# EAGLE design SerialSignal (EAGLE 6.1)
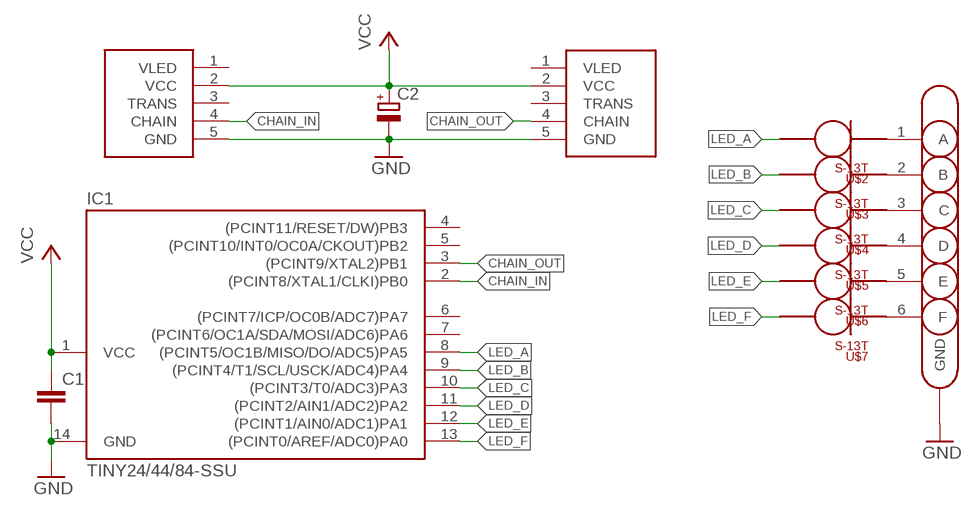
[diagram p0: schematic, sheet 1]

## Parts
C1  C-EUC0603  [C0603]
C2  CPOL-EUSMCC  [SMC_C]
IC1  TINY24/44/84-SSU  [SOIC14]
SMD1  SERIAL_SENSOR  [SERIAL_4]
SMD2  SERIAL_SENSOR  [SERIAL_4]
U$1  SIGNAL_CONNECTOR  [SIGNEL_CONNECTOR]
U$2  S-13T  [S-1*3T]
U$3  S-13T  [S-1*3T]
U$4  S-13T  [S-1*3T]
U$5  S-13T  [S-1*3T]
U$6  S-13T  [S-1*3T]
U$7  S-13T  [S-1*3T]

## Nets
CHAIN_IN: IC1.2((PCINT8/XTAL1/CLKI)PB0) SMD1.4(CHAIN)
CHAIN_OUT: IC1.3((PCINT9/XTAL2)PB1) SMD2.4(CHAIN)
GND: C1.2 C2.- IC1.14(GND) SMD1.5(GND) SMD2.5(GND) U$1.GND
LED_A: IC1.8((PCINT5/OC1B/MISO/DO/ADC5)PA5) U$2.A
LED_B: IC1.9((PCINT4/T1/SCL/USCK/ADC4)PA4) U$3.A
LED_C: IC1.10((PCINT3/T0/ADC3)PA3) U$4.A
LED_D: IC1.11((PCINT2/AIN1/ADC2)PA2) U$5.A
LED_E: IC1.12((PCINT1/AIN0/ADC1)PA1) U$6.A
LED_F: IC1.13((PCINT0/AREF/ADC0)PA0) U$7.A
N$7: U$1.1(A) U$2.C
N$8: U$1.2(B) U$3.C
N$9: U$1.3(C) U$4.C
N$10: U$1.4(D) U$5.C
N$11: U$1.5(E) U$6.C
N$12: U$1.6(F) U$7.C
VCC [vcc]: C1.1 C2.+ IC1.1(VCC) SMD1.2(VCC) SMD2.2(VCC)
Unconnected: IC1.4((PCINT11/RESET/DW)PB3) IC1.5((PCINT10/INT0/OC0A/CKOUT)PB2) IC1.6((PCINT7/ICP/OC0B/ADC7)PA7) IC1.7((PCINT6/OC1A/SDA/MOSI/ADC6)PA6) SMD1.1(VLED) SMD1.3(TRANS) SMD2.1(VLED) SMD2.3(TRANS)

## Library data of the parts
C1 = rcl:C-EU: CAPACITOR, European symbol
C2 = rcl:CPOL-EU: POLARIZED CAPACITOR, European symbol
IC1 = avr-7:TINY24/44/84
SMD1 SMD2 = myparts:SERIAL_SENSOR
U$1 = myparts:SIGNAL_CONNECTOR
U$2-U$7 = myparts:S-1*3T

## Net classes
1 vcc: width 0.508 mm

## Board
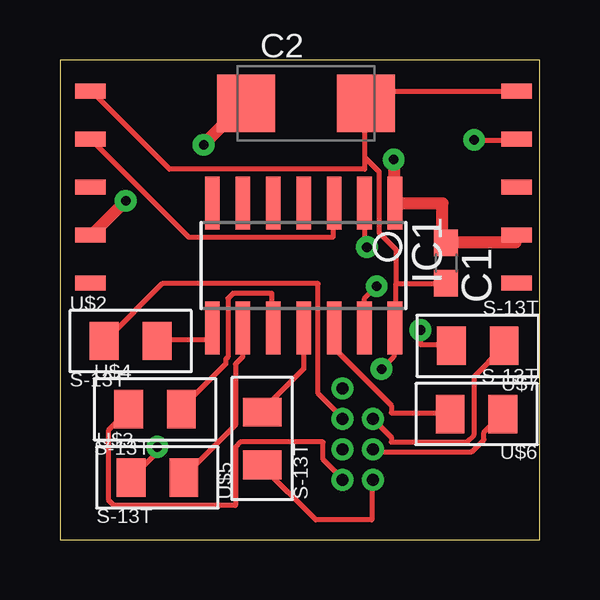
[diagram p1: board, top side]
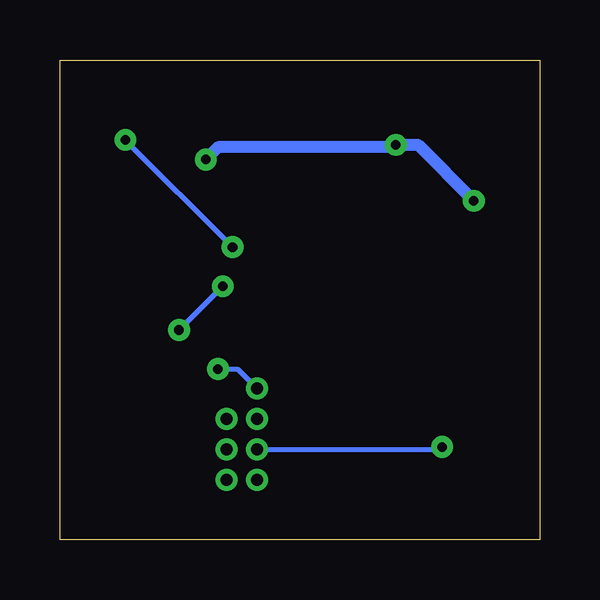
[diagram p2: board, bottom side, seen from below]

Size 20 x 20 mm. Coordinates in mm from the lower left corner, seen from the top.
Outline: 0,0 20,0 20,20 0,20 0,0
Copper layers (1*16): Top 0.035mm / dielectric 1.5mm / Bottom 0.035mm
Design rules: minimum track width 8mil, minimum drill 0.4mm, track to track 8mil, track to pad 8mil, pad to pad 8mil, via to via 8mil, smd to smd 8mil, copper to edge 20mil, drill to drill 8mil, minimum pad ring 8mil, minimum via ring 10mil, stop-mask expansion 3mil, vias tented up to drill 0mil, thermal gap 8mil

### Footprints (pad centres in the part's own frame; a part is rotated, then mirrored left to right if it is on the bottom)
C0603 = smd 1.1 x 1: 1 -0.85,0; 2 0.85,0
SMC_C = smd 2.4 x 2.4: + -2.5,0; - 2.5,0
SOIC14 = smd 0.61 x 2.21: 1 -3.81,-2.603; 2 -2.54,-2.603; 3 -1.27,-2.603; 4 0,-2.603; 5 1.27,-2.603; 6 2.54,-2.603; 7 3.81,-2.603; 8 3.81,2.603; 9 2.54,2.603; 10 1.27,2.603; 11 0,2.603; 12 -1.27,2.603; 13 -2.54,2.603; 14 -3.81,2.603
SERIAL_4 = smd 0.635 x 1.27: 1 -2,0; 2 0,0; 3 2,0; 4 4,0; 5 6,0
SIGNEL_CONNECTOR = drill 0.5: 1 -2.54,0; 2 -1.27,0; 3 0,0; 4 0,1.27; 5 -1.27,1.27; 6 -2.54,1.27; GND -3.81,0
S-1*3T = smd 1.2 x 1.6: A 1.1,0; C -1.1,0

### Placement (x,y rotation side)
C1  16.1,11.53 270 top
C2  10.26,18.19 0 top
IC1  10.16,11.43 180 top
SMD1  19.05,12.7 90 top
SMD2  1.27,12.7 90 top
U$1  11.79,2.49 270 top
U$2  2.95,8.28 0 top
U$3  4.06,2.59 0 top
U$4  3.96,5.44 0 top
U$5  8.43,4.22 90 top
U$6  17.37,5.23 180 top
U$7  17.42,8.08 180 top

### Tracks (layer width: path | path; a pad name or v marks a point on that pad's centre or on a via)
CHAIN_IN  (via drill 0.4)
  Top 0.203: v17.27,16.66 19,16.66 SMD1.4 | v12.8,12.19 12.7,12.29 IC1.2
  Bottom 0.203: v12.8,12.19 v17.27,16.66
CHAIN_OUT
  Top 0.203: SMD2.4 1.32,16.66 5.38,12.6 11.38,12.6 11.38,14.02 IC1.3
GND  (via drill 0.4)
  Top 0.203: 14.02,10.67 16.05,10.67 C1.2 | 14.02,10.67 14.02,8.84 IC1.14 13.92,8.74 13.92,7.62 v13.41,7.11 | 12.7,15.95 12.7,18.19 C2.- 12.8,18.19 12.8,18.69 19,18.69 SMD1.5 | 12.7,15.95 12.7,15.44 4.57,15.44 1.32,18.69 SMD2.5 | 14.02,10.67 14.02,12.09 13.31,12.8 13.31,15.34 12.7,15.95
  Bottom 0.203: U$1.GND 12.6,7.11 v13.41,7.11
LED_A
  Top 0.203: U$2.A 4.06,8.33 6.3,8.33 6.3,8.74 IC1.8
LED_B
  Top 0.203: IC1.9 7.62,7.62 7.32,7.32 7.32,4.78 5.18,2.64 U$3.A
LED_C
  Top 0.203: U$4.A 5.08,5.49 6.91,7.32 6.91,7.52 7.01,7.62 7.01,10.06 7.21,10.26 8.84,10.26 8.84,8.84 IC1.10
LED_D
  Top 0.203: IC1.11 10.16,7.11 8.43,5.38 U$5.A
LED_E
  Top 0.203: U$6.A 16.26,5.28 13.82,5.28 13.82,5.59 11.48,7.92 11.48,8.74 IC1.12
LED_F  (via drill 0.4)
  Top 0.203: v15.04,8.74 15.04,8.13 16.26,8.13 U$7.A | v13.21,10.57 12.7,10.06 IC1.13
  Bottom 0.203: v13.21,10.57 v15.04,8.74
N$7
  Top 0.203: U$2.C 1.93,8.33 4.27,10.67 10.77,10.67 10.77,6.1 11.79,5.08 U$1.1
N$8  (via drill 0.4)
  Top 0.203: v4.06,3.86 4.06,3.66 3.05,2.64 U$3.C
  Bottom 0.203: v4.06,3.86 4.17,3.76 U$1.2
N$9
  Top 0.203: U$4.C 2.85,5.38 2.03,4.57 2.03,1.63 2.23,1.42 7.32,1.42 7.32,3.86 7.52,4.06 10.97,4.06 10.97,3.35 11.79,2.54 U$1.3
N$10
  Top 0.203: U$5.C 8.43,3.05 10.67,0.81 13.01,0.81 13.01,2.44 U$1.4
N$11
  Top 0.203: U$6.C 18.39,5.18 17.68,4.47 17.68,4.17 17.17,3.66 13.11,3.66 13.11,3.76 U$1.5
N$12
  Top 0.203: U$1.6 13.82,4.27 13.82,4.06 16.97,4.06 17.27,4.37 17.27,6.81 18.49,8.03 U$7.C
VCC  (via drill 0.4)
  Top 0.508: SMD1.2 19,12.7 19,12.39 16.15,12.39 C1.1 15.95,12.6 15.95,14.02 14.02,14.02 IC1.1 13.92,14.22 v13.92,15.85 | v2.74,14.12 1.32,12.7 SMD2.2 | v5.99,16.46 7.72,18.19 C2.+
  Bottom 0.508: v2.74,14.12 5.08,16.46 v5.99,16.46 6.2,16.36 13.41,16.36 v13.92,15.85